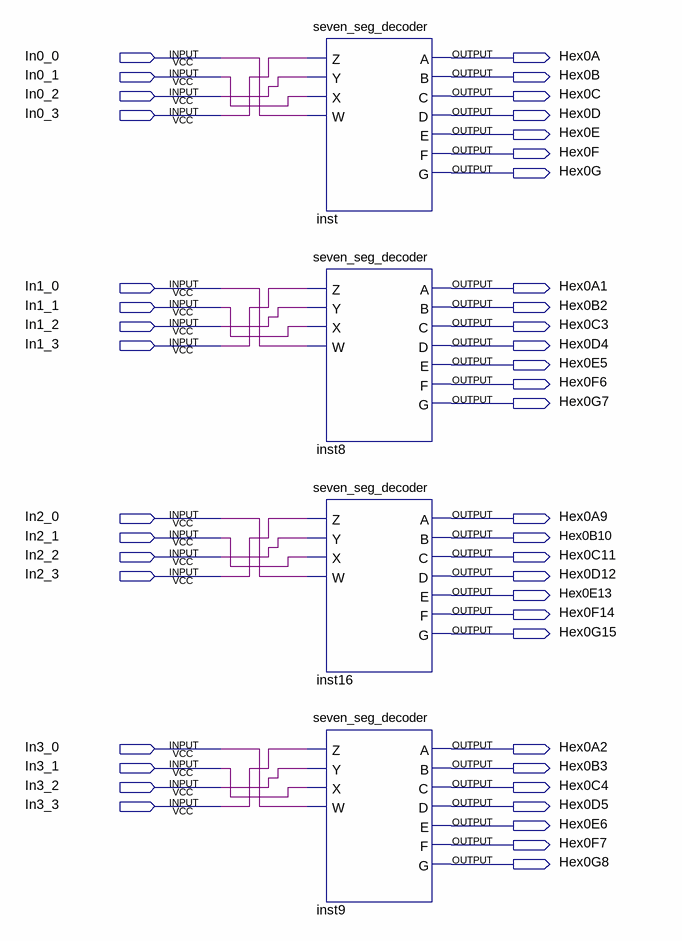
[diagram p0: schematic sheet]
// Quartus schematic 4x_seven_seg_display.bdf as structural Verilog: 4 symbols, 44 pins
module \4x_seven_seg_display  (
  input  In0_0,
  input  In0_1,
  input  In0_2,
  input  In0_3,
  input  In1_0,
  input  In1_1,
  input  In1_2,
  input  In1_3,
  input  In2_0,
  input  In2_1,
  input  In2_2,
  input  In2_3,
  input  In3_0,
  input  In3_1,
  input  In3_2,
  input  In3_3,
  output Hex0A,
  output Hex0B,
  output Hex0C,
  output Hex0D,
  output Hex0E,
  output Hex0F,
  output Hex0G,
  output Hex0A1,
  output Hex0B2,
  output Hex0C3,
  output Hex0D4,
  output Hex0E5,
  output Hex0F6,
  output Hex0G7,
  output Hex0A9,
  output Hex0B10,
  output Hex0C11,
  output Hex0D12,
  output Hex0E13,
  output Hex0F14,
  output Hex0G15,
  output Hex0A2,
  output Hex0B3,
  output Hex0C4,
  output Hex0D5,
  output Hex0E6,
  output Hex0F7,
  output Hex0G8
);

  seven_seg_decoder inst (
    .Z(In0_3), .Y(In0_2), .X(In0_1), .W(In0_0), .A(Hex0A), .B(Hex0B), .C(Hex0C), .D(Hex0D), .E(Hex0E),
    .F(Hex0F), .G(Hex0G));
  seven_seg_decoder inst8 (
    .Z(In1_3), .Y(In1_2), .X(In1_1), .W(In1_0), .A(Hex0A1), .B(Hex0B2), .C(Hex0C3), .D(Hex0D4), .E(Hex0E5),
    .F(Hex0F6), .G(Hex0G7));
  seven_seg_decoder inst16 (
    .Z(In2_3), .Y(In2_2), .X(In2_1), .W(In2_0), .A(Hex0A9), .B(Hex0B10), .C(Hex0C11), .D(Hex0D12),
    .E(Hex0E13), .F(Hex0F14), .G(Hex0G15));
  seven_seg_decoder inst9 (
    .Z(In3_3), .Y(In3_2), .X(In3_1), .W(In3_0), .A(Hex0A2), .B(Hex0B3), .C(Hex0C4), .D(Hex0D5), .E(Hex0E6),
    .F(Hex0F7), .G(Hex0G8));
endmodule
